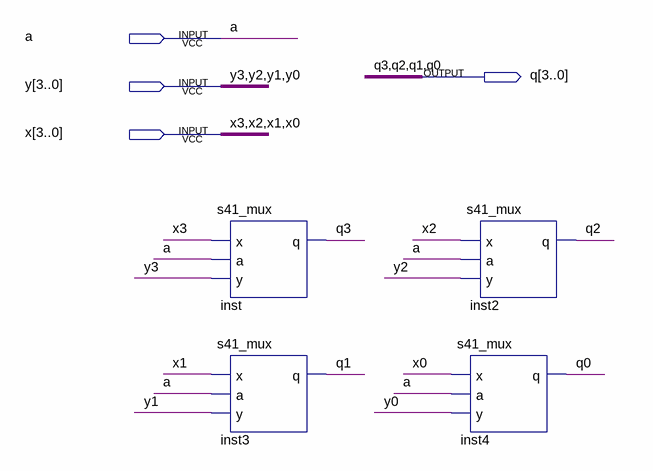
[diagram p0: schematic sheet]
// Quartus schematic s42_mux.bdf as structural Verilog: 4 symbols, 4 pins
module s42_mux (
  input  a,
  input  [3:0] y,
  input  [3:0] x,
  output [3:0] q
);

  s41_mux inst (.x(x[3]), .a(a), .y(y[3]), .q(q[3]));
  s41_mux inst3 (.x(x[1]), .a(a), .y(y[1]), .q(q[1]));
  s41_mux inst2 (.x(x[2]), .a(a), .y(y[2]), .q(q[2]));
  s41_mux inst4 (.x(x[0]), .a(a), .y(y[0]), .q(q[0]));
endmodule
